# EAGLE schematic CapteurTemperature (EAGLE 7.6.0)
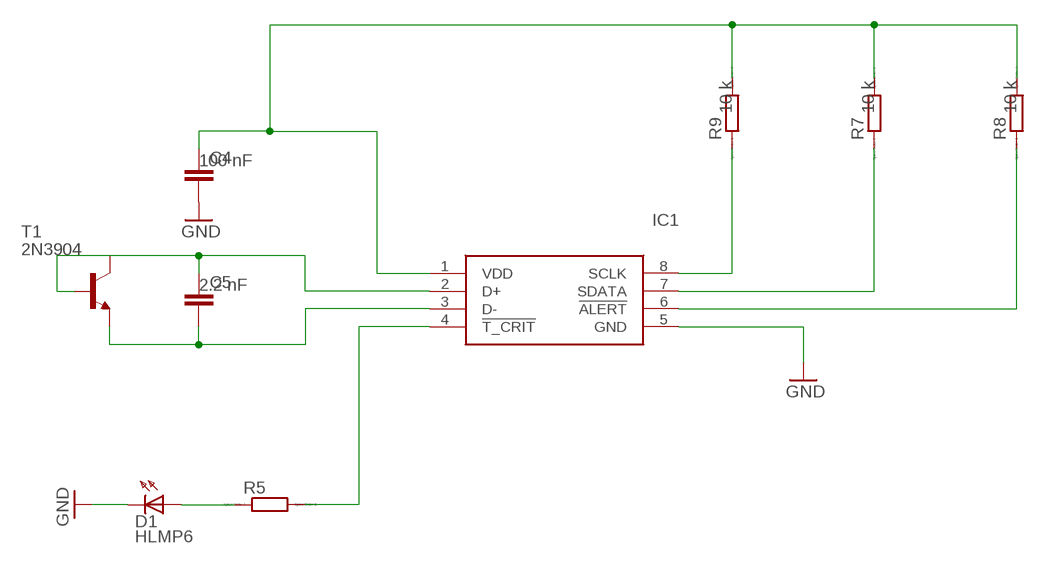
[diagram p0: schematic, sheet 1]

## Parts
C4  C-EUC0603  [C0603]
C5  C-EUC0603  [C0603]
D1  HLMP6  [HLMP6]
IC1  SA56004AD,118  [SOIC127P600X175-8N]
R5  RR0603  [R0603]
R7  RR0603  [R0603]
R8  RR0603  [R0603]
R9  RR0603  [R0603]
T1  2N3904  [TO92]

## Nets
GND: C4.2 D1.K IC1.5(GND)
N$1: C4.1 IC1.1(VDD) R7.2 R8.2 R9.2
N$2: IC1.6(!ALERT) R8.1
N$3: IC1.7(SDATA) R7.1
N$4: IC1.8(SCLK) R9.1
N$5: C5.1 IC1.2(D+) T1.1(C) T1.2(B)
N$6: C5.2 IC1.3(D-) T1.3(E)
N$7: IC1.4(!T_CRIT) R5.2
N$8: D1.A R5.1

## Library data of the parts
C4 = rcl:C-EU: CAPACITOR, European symbol; C1: 100 nF
C5 = rcl:C-EU: CAPACITOR, European symbol; C2: 2.2 nF
D1 = display-hp:HLMP6: LED 2mm horizontal; MF: AGILENT TECHNOLOGIES; MPN: HLMP-6500; OC_FARNELL: 1652490; OC_NEWARK: 40K0088
IC1 = SA56004AD_118:SA56004AD,118: Board Mount Temperature Sensors I2C LOC +/- 2OC AND Source: Datasheet <http://www.nxp.com/docs/en/data-sheet/SA56004X.pdf>; ARROW_PART_NUMBER: SA56004AD,118; ARROW_PRICE-STOCK: https://www.arrow.com/en/products/sa56004ad118/nxp-semiconductors?region=nac; DESCRIPTION: Board Mount Temperature Sensors I2C LOC +/- 2OC AND; HEIGHT: 1.75mm; MANUFACTURER_NAME: NXP; MANUFACTURER_PART_NUMBER: SA56004AD,118; MOUSER_PART_NUMBER: 771-SA56004AD118; MOUSER_PRICE-STOCK: https://www.mouser.co.uk/ProductDetail/NXP-Semiconductors/SA56004AD118?qs=LOCUfHb8d9uULHX2Om8wPw%3D%3D
R5 = eagle-ltspice:R: RESISTOR, European symbol; SPICEMODEL: NONE; SPICEPREFIX: R
R7-R9 = eagle-ltspice:R: RESISTOR, European symbol; R: 10 k; SPICEMODEL: NONE; SPICEPREFIX: R
T1 = transistor:2N3904: NPN TRANSISTOR